# EAGLE design RX-FM-Radio-1.5V-dip (EAGLE 7.2.0)
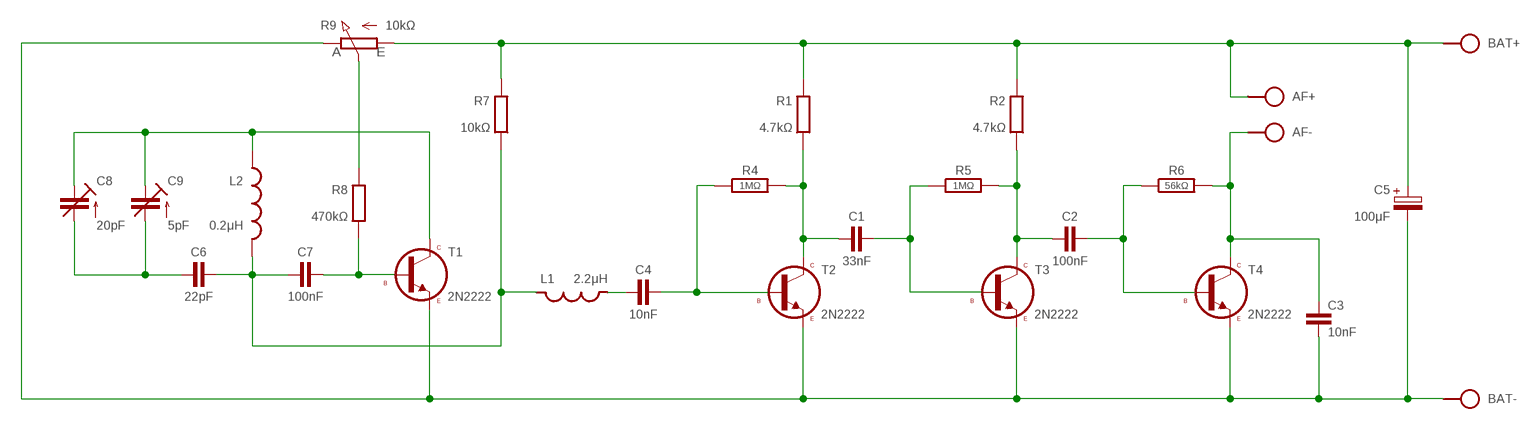
[diagram p0: schematic, sheet 1]

## Parts
AF  SPAD+-+-  [SPAD+-]
BAT  SPAD+-+-  [SPAD+-]
C1  33nF  C-H050-020X044  [C050-020X044]
C2  100nF  C-H050-020X044  [C050-020X044]
C3  10nF  C025-025X060  [C050-025X060]
C4  10nF  C-H050-020X044  [C050-020X044]
C5  100μF  CPOLE2,5-4/V  [E2.5-4/V]
C6  22pF  C-H050-020X036  [C050-020X036]
C7  100nF  C-H050-020X044/V  [C050-020X044/V]
C8  20pF  C-TR-PH201272222-808-2PIND  [TRIM-2222-808]
C9  5pF  C-TR-PH20127-TZ03  [CTRIMTZ03]
L1  2.2μH  L-H-SHORT-03/10  [L-03/10]
L2  0.2μH  L10/10Y  [L-10/10Y]
R1  4.7kΩ  R0204/10-V  [0204/10-V]
R2  4.7kΩ  R0204/10-V  [0204/10-V]
R4  1MΩ  R-H0204/10-V  [0204/10-V]
R5  1MΩ  R-H0204/10-V  [0204/10-V]
R6  56kΩ  R-H0204/10-V  [0204/10-V]
R7  10kΩ  R0204/10-V  [0204/10-V]
R8  470kΩ  R0204/10-V  [0204/10-V]
R9  10kΩ  POT-H-3P  [CONN-3P]
T1  2N2222  [TO92]
T2  2N2222  [TO92]
T3  2N2222  [TO92]
T4  2N2222  [TO92]

## Nets
N$1: C1.2 R5.1 T3.2(B)
N$2: C2.1 R2.2 R5.2 T3.3(C)
N$3: C1.1 R1.2 R4.2 T2.3(C)
N$4: C2.2 R6.1 T4.2(B)
N$5: AF.1 C3.1 R6.2 T4.3(C)
N$7: C4.2 R4.1 T2.2(B)
N$8: C4.1 L1.1
N$10: AF.2 BAT.2 C5.+ R1.1 R2.1 R7.1 R9.1(A)
N$11: C7.2 R8.2 T1.2(B)
N$12: R8.1 R9.2(S)
N$13: C8.3(E) C9.2(E) L2.P$1 T1.3(C)
N$14: C6.2 C7.1 L1.2 L2.P$2 R7.2
N$15: C6.1 C8.2(A) C9.1(A)
N$16: BAT.1 C3.2 C5.- R9.3(E) T1.1(E) T2.1(E) T3.1(E) T4.1(E)

## Library data of the parts
AF BAT = pad:SPAD+-
C1 C2 C4 C6 C7 = c:C-H
C3 = c:C: CAPACITOR, European symbol
C5 = c:CPOL: POLARIZED CAPACITOR, European symbol
C8 C9 = cap-trim:C-TR-PH20127
L1 = l:L-H-SHORT
L2 = l:L: Potentiometers Beckman, Copal, Piher, Spectrol, Schukat Created by librarian@cadsoft.de
R1 R2 R7 R8 = r:R: RESISTOR, European symbol
R4-R6 = r:R-H
R9 = r:POT-H
T1-T4 = t:2N2222

## Board
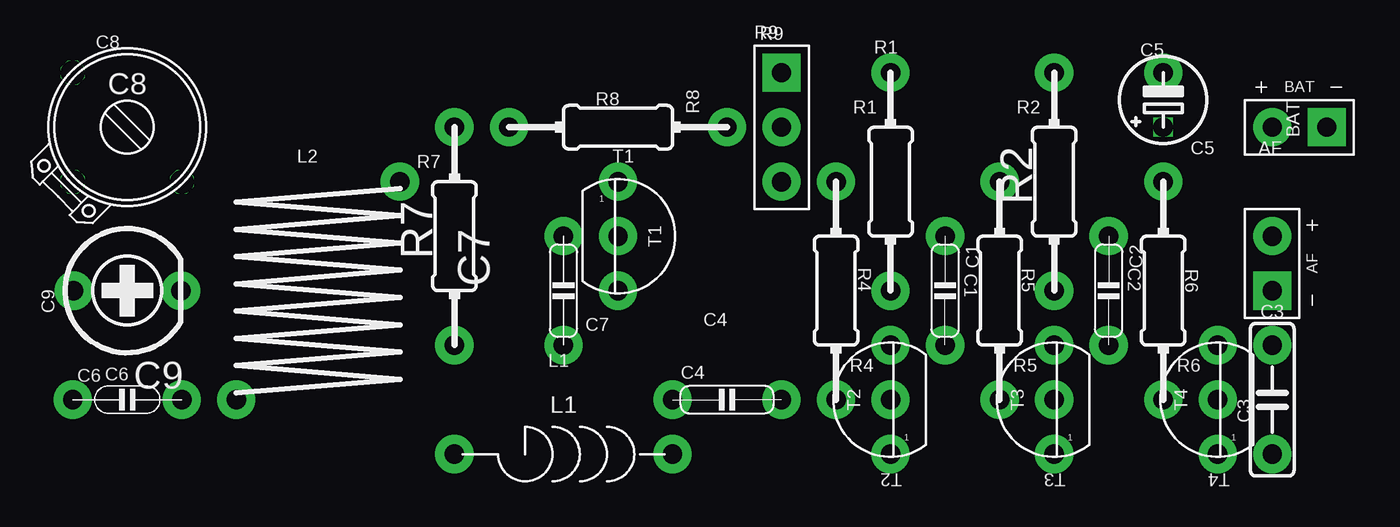
[diagram p1: board, top side]
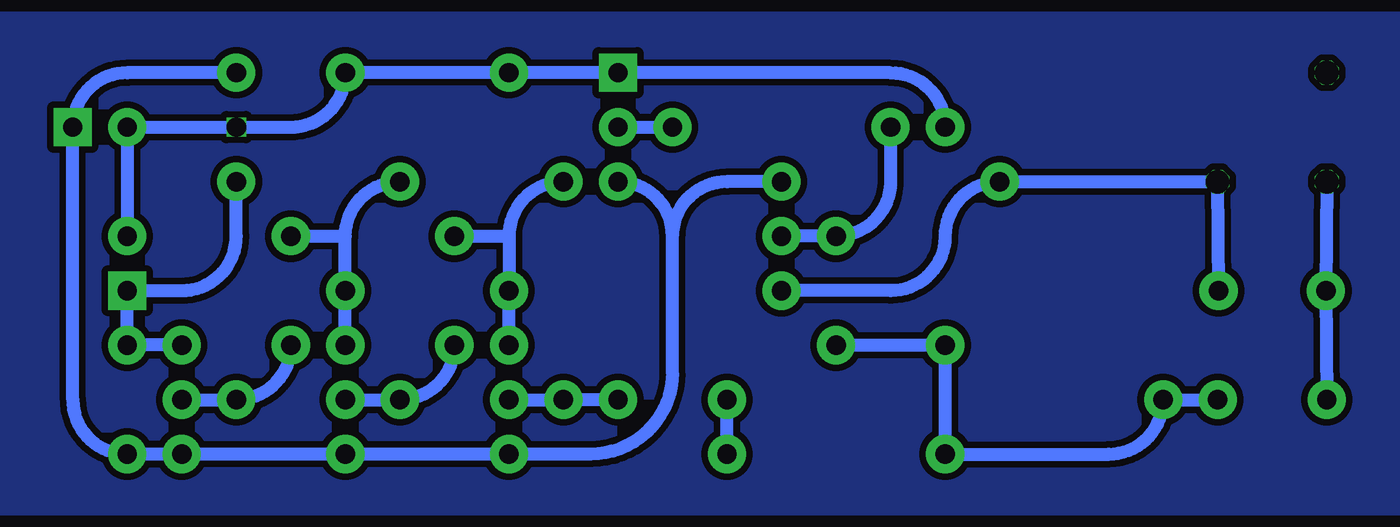
[diagram p2: board, bottom side, seen from below]

No outline drawn. Coordinates in mm, seen from the top.
Copper layers (1*16): Top 0.035mm / dielectric 1.5mm / Bottom 0.035mm
Design rules "default *": minimum track width 10mil, minimum drill 0.61mm, track to track 8mil, track to pad 8mil, pad to pad 8mil, via to via 8mil, smd to smd 8mil, copper to edge 40mil, drill to drill 8mil, minimum pad ring 0mil, minimum via ring 8mil, stop-mask expansion 2mil, vias tented up to drill 19mil, thermal gap 10mil

### Footprints (pad centres in the part's own frame; a part is rotated, then mirrored left to right if it is on the bottom)
SPAD+- = drill 0.9 pad 1.778 square: 1 0,-1.27 | drill 0.9 pad 1.778: 2 0,1.27
C050-020X044 = drill 0.9 pad 1.778: 1 -2.54,0; 2 2.54,0
C050-025X060 = drill 0.9 pad 1.778: 1 0,2.54; 2 0,-2.54
E2.5-4/V = drill 0.9 square: + 0,1.27 | drill 0.9 pad 1.778: - 0,-1.27
C050-020X036 = drill 0.9 pad 1.778: 1 -2.54,0; 2 2.54,0
C050-020X044/V = drill 0.9 pad 1.778: 1 0,2.54; 2 0,-2.54
TRIM-2222-808 = drill 1.1 octagon: 1 -2.54,2.54; 2 -2.54,-2.54; 3 2.54,-2.54
CTRIMTZ03 = drill 0.9 pad 1.778: 1 0,2.5; 2 0,-2.5
L-03/10 = drill 0.9 pad 1.778: 1 5.08,0; 2 -5.08,0
L-10/10Y = drill 0.9 pad 1.778: P$1 5.08,2.54; P$2 -2.54,-7.62
0204/10-V = drill 0.9 pad 1.778: 1 0,5.08; 2 0,-5.08
CONN-3P = drill 0.9 pad 1.778 square: 1 0,2.54 | drill 0.9 pad 1.778: 2 0,0; 3 0,-2.54
TO92 = drill 0.9 pad 1.778: 1 0,2.54; 2 0,0; 3 0,-2.54

### Placement (x,y rotation side)
AF  60.96,11.43 0 top
BAT  62.23,17.78 90 top
C1  45.72,10.16 270 top
C2  53.34,10.16 270 top
C3  60.96,5.08 0 top
C4  35.56,5.08 0 top
C5  55.88,19.05 180 top
C6  7.62,5.08 0 top
C7  27.94,10.16 180 top
C8  7.62,17.78 0 top
C9  7.62,10.16 90 top
L1  27.94,2.54 0 top
L2  15.24,12.7 0 top
R1  43.18,15.24 0 top
R2  50.8,15.24 0 top
R4  40.64,10.16 180 top
R5  48.26,10.16 180 top
R6  55.88,10.16 180 top
R7  22.86,12.7 0 top
R8  30.48,17.78 270 top
R9  38.1,17.78 0 top
T1  30.48,12.7 0 top
T2  43.18,5.08 180 top
T3  50.8,5.08 180 top
T4  58.42,5.08 180 top

### Tracks (layer width: path | path; a pad name or v marks a point on that pad's centre or on a via)
GND
  pour Bottom (isolate 0.305): 0,22.86 68.58,22.86 68.58,0 0,0
N$1
  Bottom 0.61: T3.2 R5.1 arc-90 C1.2
N$2
  Bottom 0.61: 50.8,12.7 R2.2 T3.3 | 50.8,12.7 arc90 R5.2 | C2.1 50.8,12.7
N$3
  Bottom 0.61: T2.3 R1.2 43.18,12.7 | R4.2 arc-90 43.18,12.7 | C1.1 43.18,12.7
N$4
  Bottom 0.61: T4.2 R6.1 arc-90 C2.2
N$5
  Bottom 0.61: T4.3 C3.1 AF.1 58.42,10.16 arc-90 55.88,12.7 R6.2
N$7
  Bottom 0.61: T2.2 R4.1 C4.2
N$8
  Bottom 0.61: L1.1 C4.1
N$10
  Bottom 0.61: AF.2 BAT.2 C5.+ 53.34,17.78 arc-90 R2.1 R1.1 R9.1 25.4,20.32 arc90 R7.1
N$11
  Bottom 0.61: R8.2 25.4,15.24 arc90 C7.2 T1.2
N$12
  Bottom 0.61: R9.2 R8.1
N$13
  Bottom 0.61: C9.2 C8.3 L2.P$1 arc-90 22.86,12.7 arc90 25.4,10.16 T1.3
N$14
  Bottom 0.61: C6.2 L2.P$2 arc90 15.24,2.54 L1.2 | 22.86,5.08 L1.2 | L1.2 R7.2 C7.1
N$15
  Bottom 0.61: C6.1 C9.1 C8.2
N$16
  Bottom 0.61: C5.- 60.96,20.32 arc-90 BAT.1 63.5,5.08 arc-90 C3.2 T4.1 T3.1 T2.1 39.37,2.54 arc-90 35.56,6.35 35.56,12.7 | 35.56,12.7 arc-90 R9.3 | T1.1 33.02,15.24 arc-90 35.56,12.7

### Text on the board
tPlace: R9 | C8 | R1 | C5 | R8 | AF | BAT | L2 | T1 | R2 | R7 | R4 | C1 | R5 | C2 | R6 | C7 | C9 | C4 | L1 | C6 | C3 | T2 | T3 | T4